# Altium schematic sheet [18] - POWER SEQUENCING.SchDoc
size A2; DocumentNumber: 18; SheetNumber: 18; SheetTotal: 20
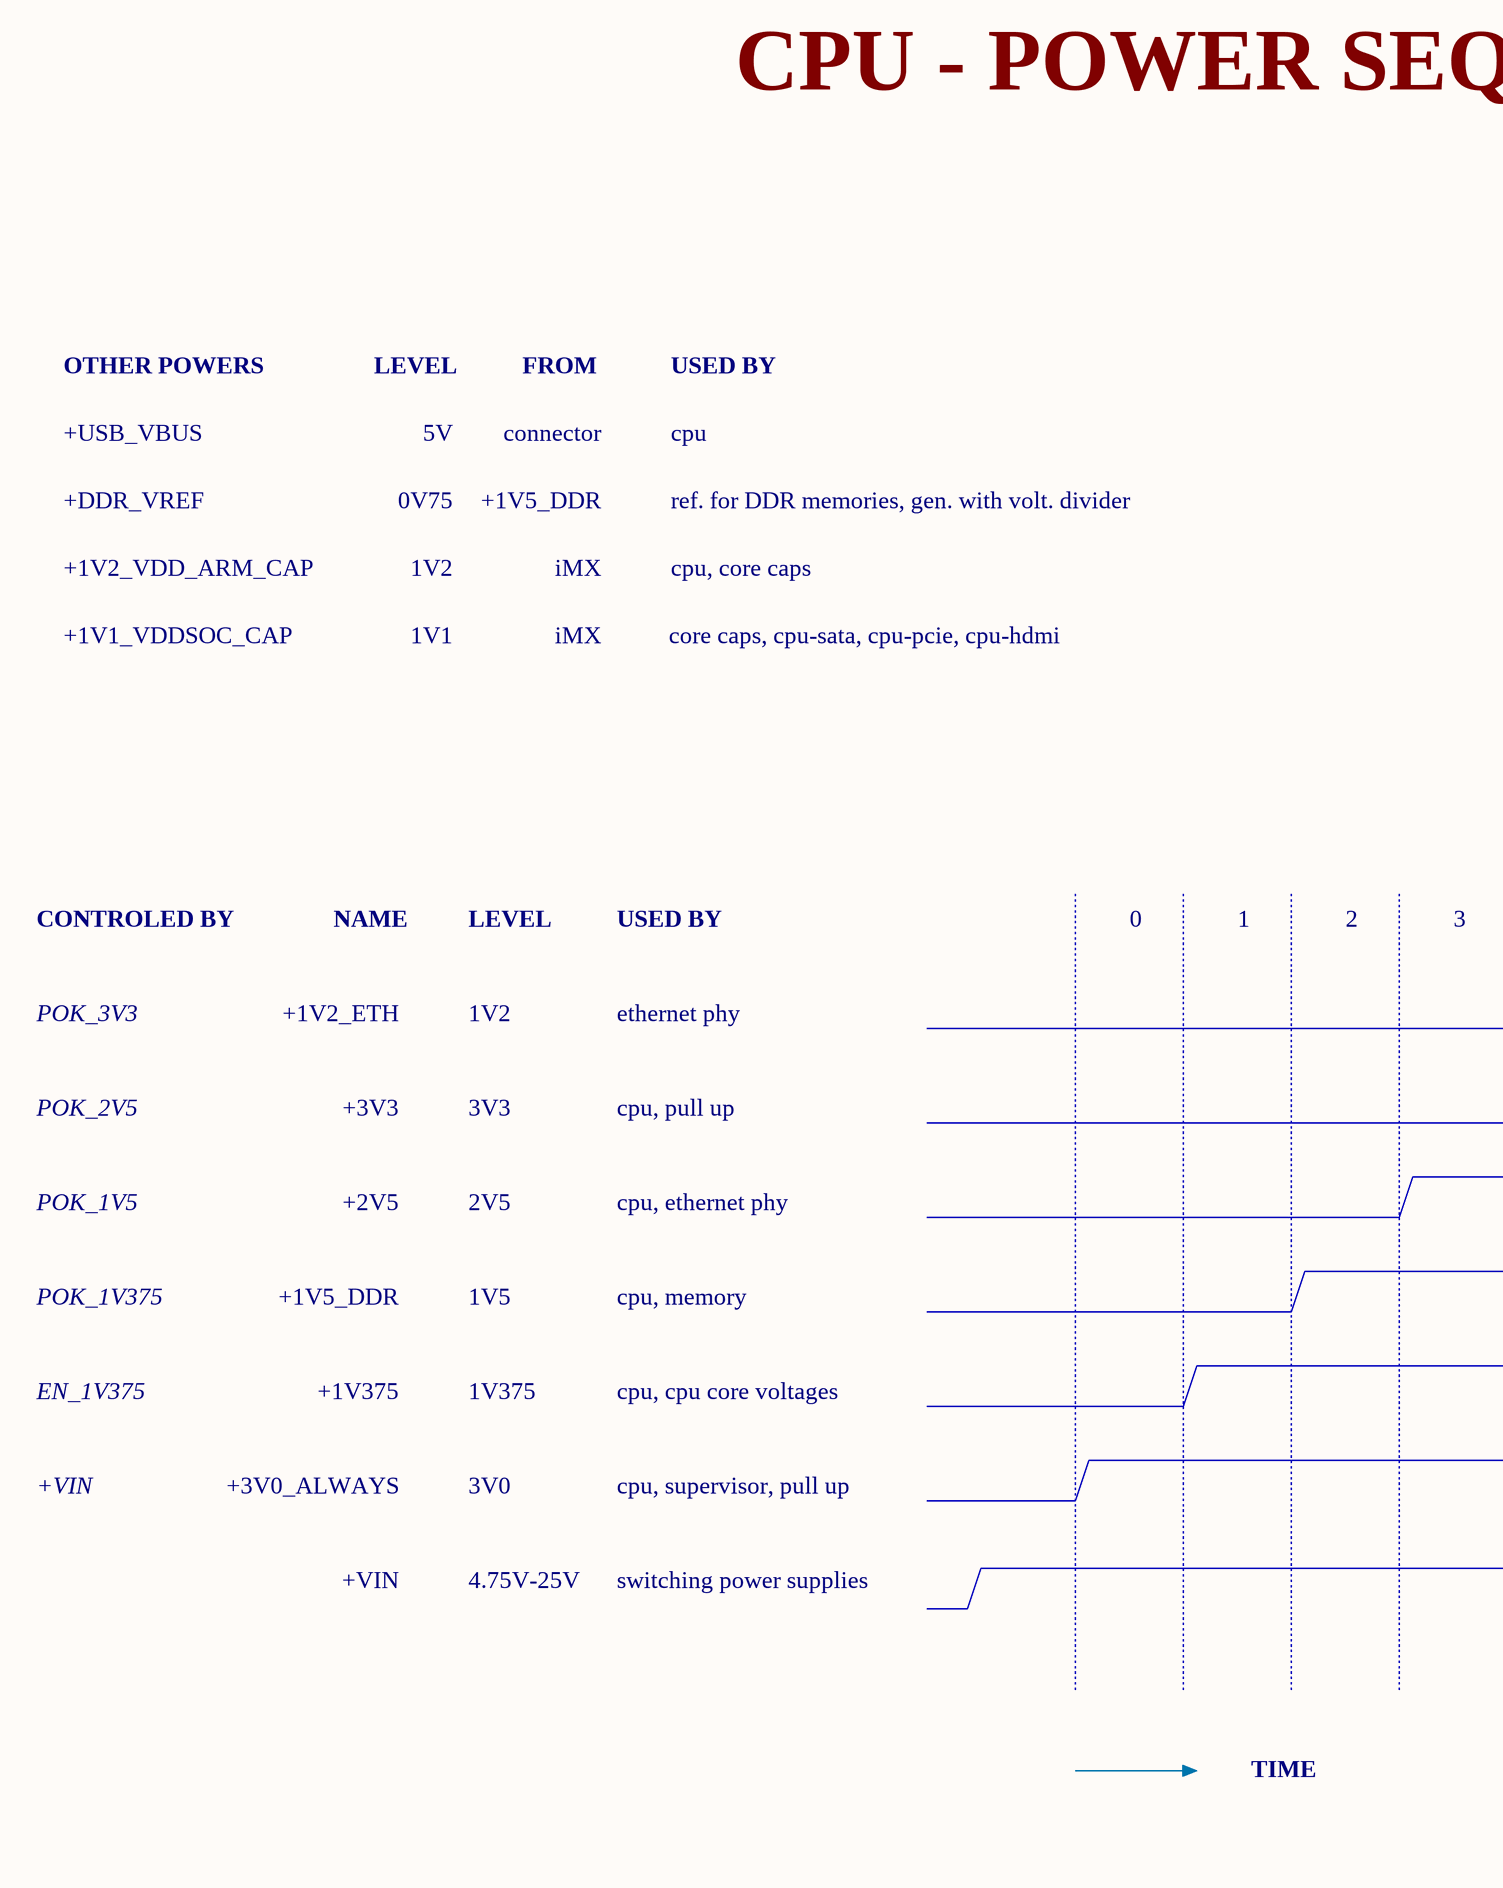
[diagram p0: [18] - POWER SEQUENCING.SchDoc, left]
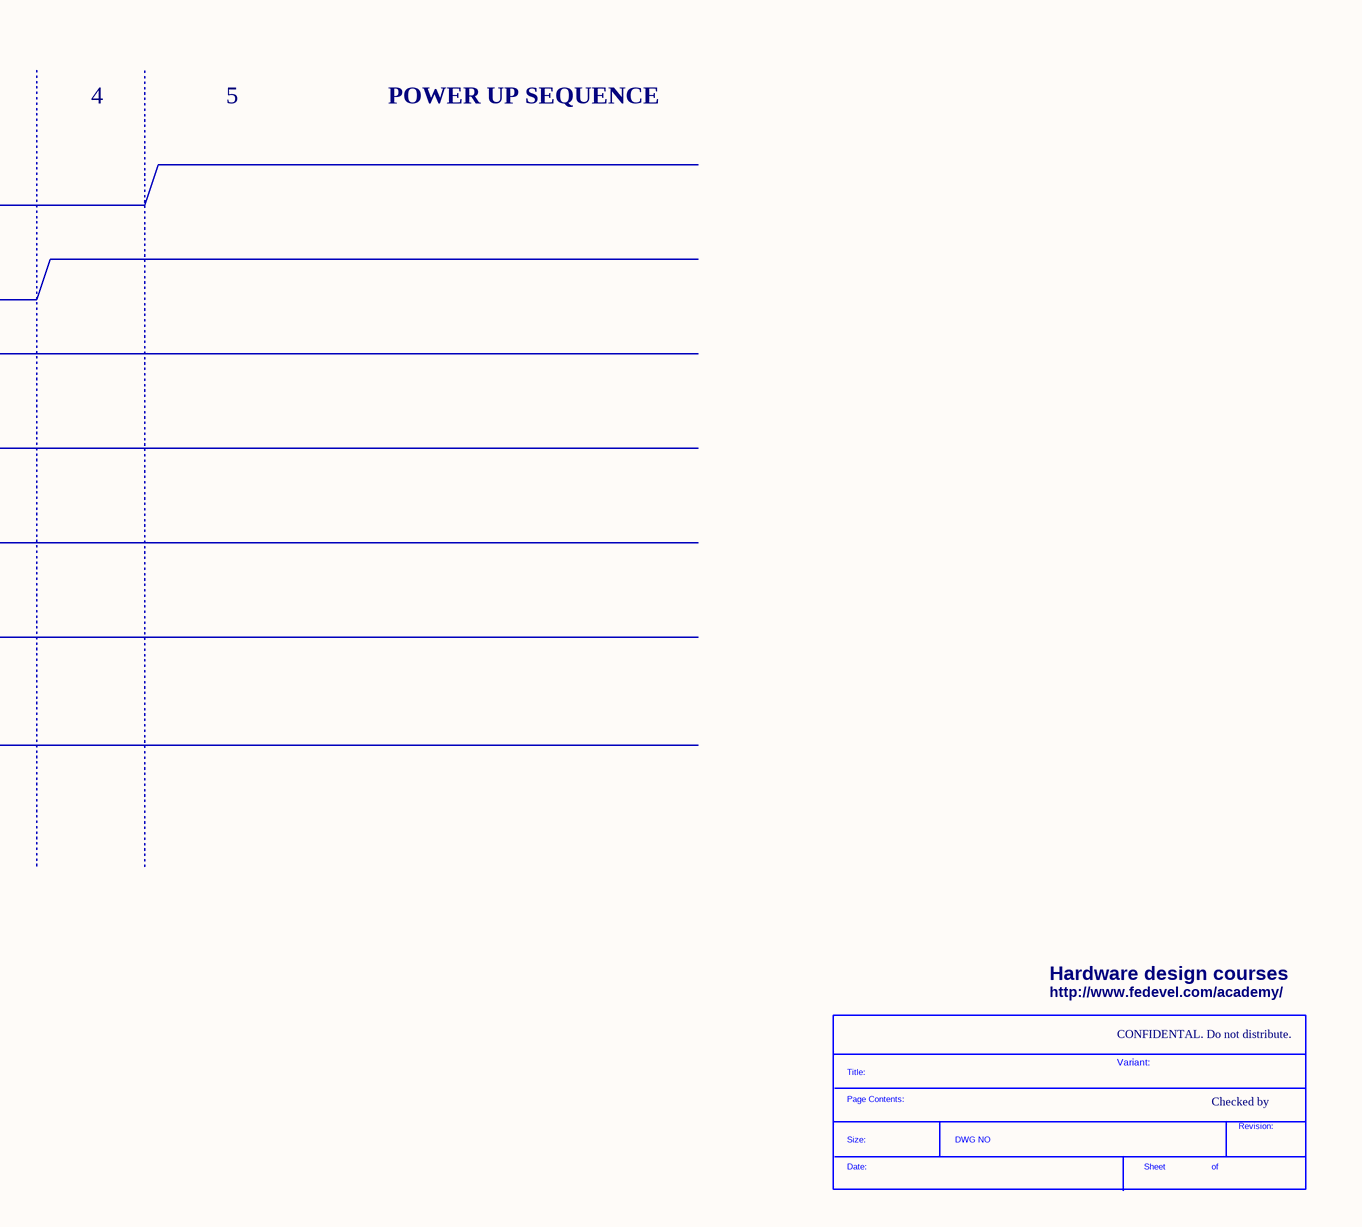
[diagram p1: [18] - POWER SEQUENCING.SchDoc, right]

## Parts
*  SDTitleBlock  (value not drawn)  (graphical)

## Notes on the sheet
- CPU - POWER SEQUENCING
- OTHER POWERS
- LEVEL
- FROM
- USED BY
- +USB_VBUS
- 5V
- connector
- cpu
- +DDR_VREF
- 0V75
- +1V5_DDR
- ref. for DDR memories, gen. with volt. divider
- +1V2_VDD_ARM_CAP
- 1V2
- iMX
- cpu, core caps
- +1V1_VDDSOC_CAP
- 1V1
- core caps, cpu-sata, cpu-pcie, cpu-hdmi
- CONTROLED BY
- NAME
- 0
- 1
- 2
- 3
- 4
- 5
- POWER UP SEQUENCE
- POK_3V3
- +1V2_ETH
- ethernet phy
- POK_2V5
- +3V3
- 3V3
- cpu, pull up
- POK_1V5
- +2V5
- 2V5
- cpu, ethernet phy
- POK_1V375
- 1V5
- cpu, memory
- EN_1V375
- +1V375
- 1V375
- cpu, cpu core voltages
- +VIN
- +3V0_ALWAYS
- 3V0
- cpu, supervisor, pull up
- 4.75V-25V
- switching power supplies
- TIME
- Hardware design courses
- http://www.fedevel.com/academy/
- CONFIDENTAL. Do not distribute.
- Variant:
- Checked by
- (in symbol SDTitleBlock) Title:; Page Contents:; Revision:; Size:; DWG NO; Date:; Sheet; of